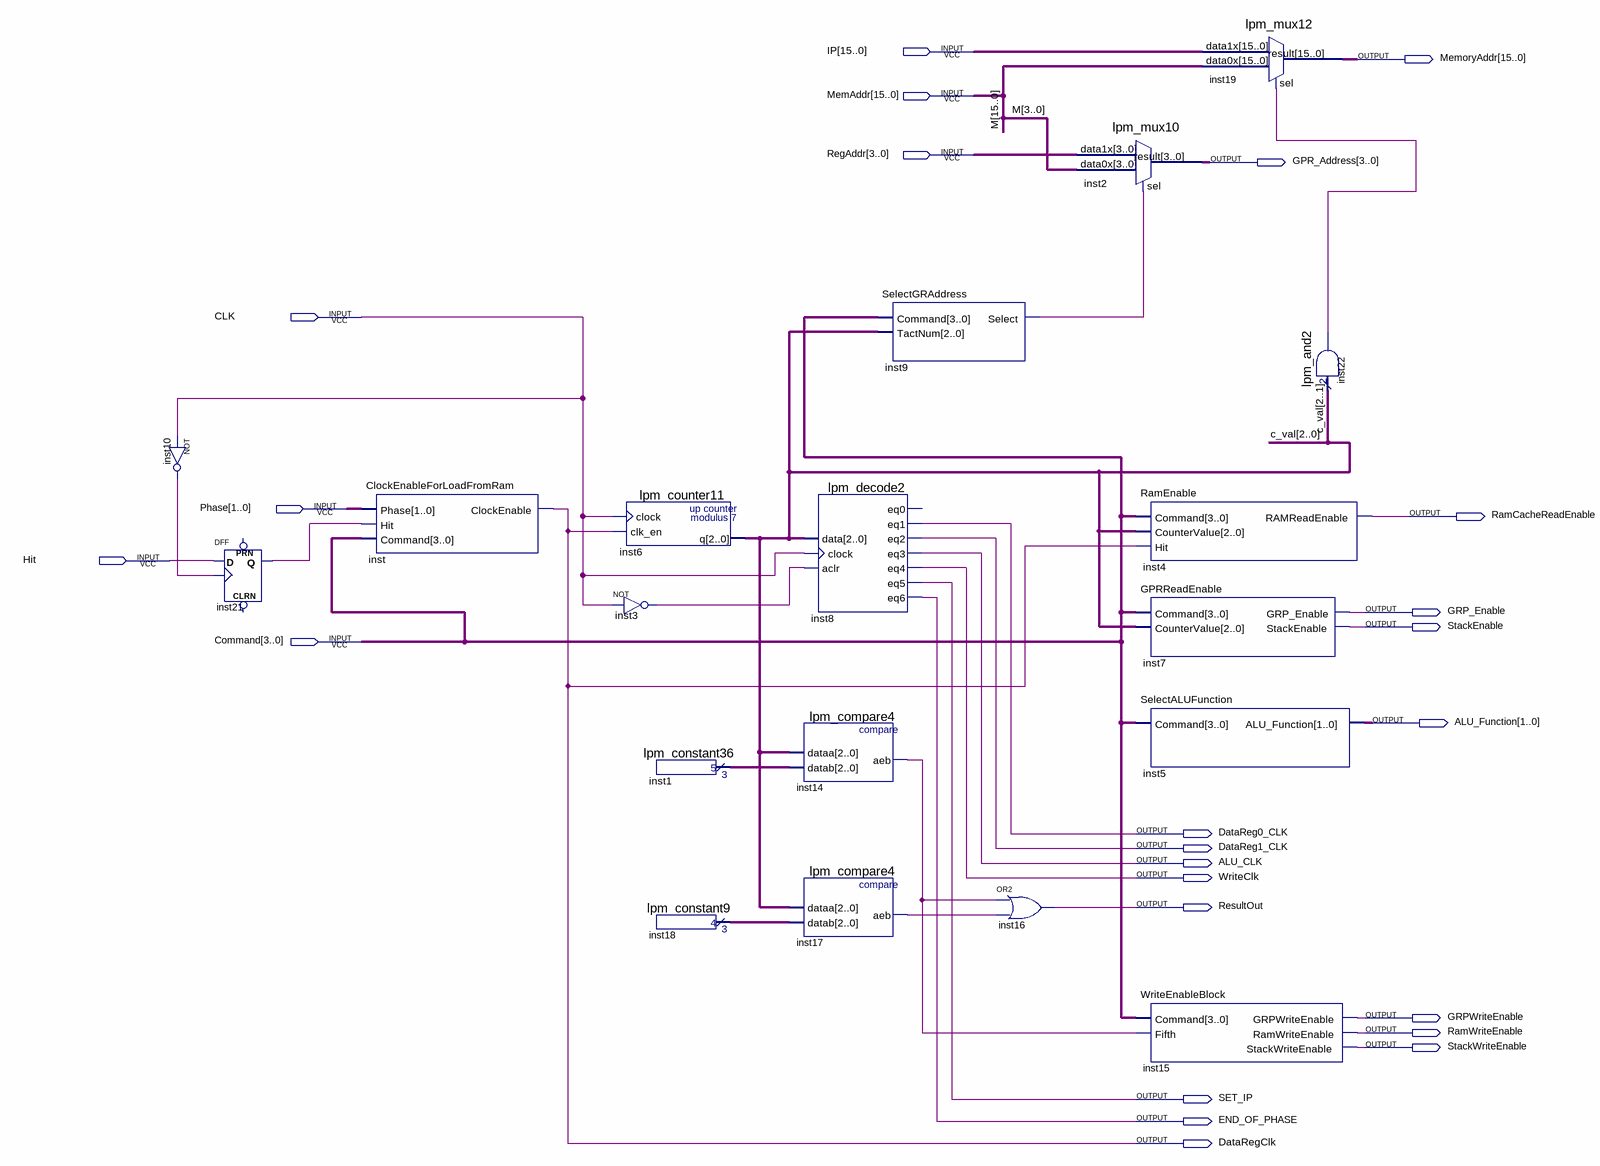
[diagram p0: schematic sheet]
// Quartus schematic LoadToDataReg.bdf as structural Verilog: 19 symbols, 24 pins
module LoadToDataReg (
  input  [15:0] IP,
  input  [15:0] MemAddr,
  input  [3:0] RegAddr,
  input  CLK,
  input  [1:0] Phase,
  input  Hit,
  input  [3:0] Command,
  output [15:0] MemoryAddr,
  output [3:0] GPR_Address,
  output RamCacheReadEnable,
  output GRP_Enable,
  output StackEnable,
  output [1:0] ALU_Function,
  output DataReg0_CLK,
  output DataReg1_CLK,
  output ALU_CLK,
  output WriteClk,
  output ResultOut,
  output GRPWriteEnable,
  output RamWriteEnable,
  output StackWriteEnable,
  output SET_IP,
  output END_OF_PHASE,
  output DataRegClk
);

  wire inst3_out, inst9_select, inst10_out, inst14_aeb, inst17_aeb, inst21_q, inst22_result;
  wire [2:0] c_val, inst1_result, inst18_result;

  not inst10 (inst10_out, CLK);
  DFF inst21 (.CLK(inst10_out), .D(Hit), .Q(inst21_q));  // open: CLRN, PRN
  ClockEnableForLoadFromRam inst (.Phase(Phase), .Hit(inst21_q), .Command(Command), .ClockEnable(DataRegClk));
  lpm_counter11 inst6 (.clock(CLK), .clk_en(DataRegClk), .q(c_val));
  not inst3 (inst3_out, CLK);
  lpm_constant36 inst1 (.result(inst1_result));
  lpm_constant9 inst18 (.result(inst18_result));
  lpm_decode2 inst8 (
    .data(c_val), .clock(CLK), .aclr(inst3_out), .eq1(DataReg0_CLK), .eq2(DataReg1_CLK), .eq3(ALU_CLK),
    .eq4(WriteClk), .eq5(SET_IP), .eq6(END_OF_PHASE));  // open: eq0
  lpm_compare4 inst14 (.dataa(c_val), .datab(inst1_result), .aeb(inst14_aeb));
  lpm_compare4 inst17 (.dataa(c_val), .datab(inst18_result), .aeb(inst17_aeb));
  SelectGRAddress inst9 (.Command(Command), .TactNum(c_val), .Select(inst9_select));
  or inst16 (ResultOut, inst14_aeb, inst17_aeb);
  lpm_mux10 inst2 (.data1x(RegAddr), .data0x(MemAddr[3:0]), .sel(inst9_select), .result(GPR_Address));
  RamEnable inst4 (.Command(Command), .CounterValue(c_val), .Hit(DataRegClk), .RAMReadEnable(RamCacheReadEnable));
  GPRReadEnable inst7 (.Command(Command), .CounterValue(c_val), .GRP_Enable(GRP_Enable), .StackEnable(StackEnable));
  SelectALUFunction inst5 (.Command(Command), .ALU_Function(ALU_Function));
  WriteEnableBlock inst15 (
    .Command(Command), .Fifth(inst14_aeb), .GRPWriteEnable(GRPWriteEnable), .RamWriteEnable(RamWriteEnable),
    .StackWriteEnable(StackWriteEnable));
  lpm_mux12 inst19 (.data1x(IP), .data0x(MemAddr), .sel(inst22_result), .result(MemoryAddr));
  lpm_and2 inst22 (.data(c_val[2:1]), .result(inst22_result));

  // Other names for the same wires on the sheet: M[15:0] = MemAddr
endmodule
